# EAGLE schematic s-tuner_bread_board (EAGLE 6.5.0)
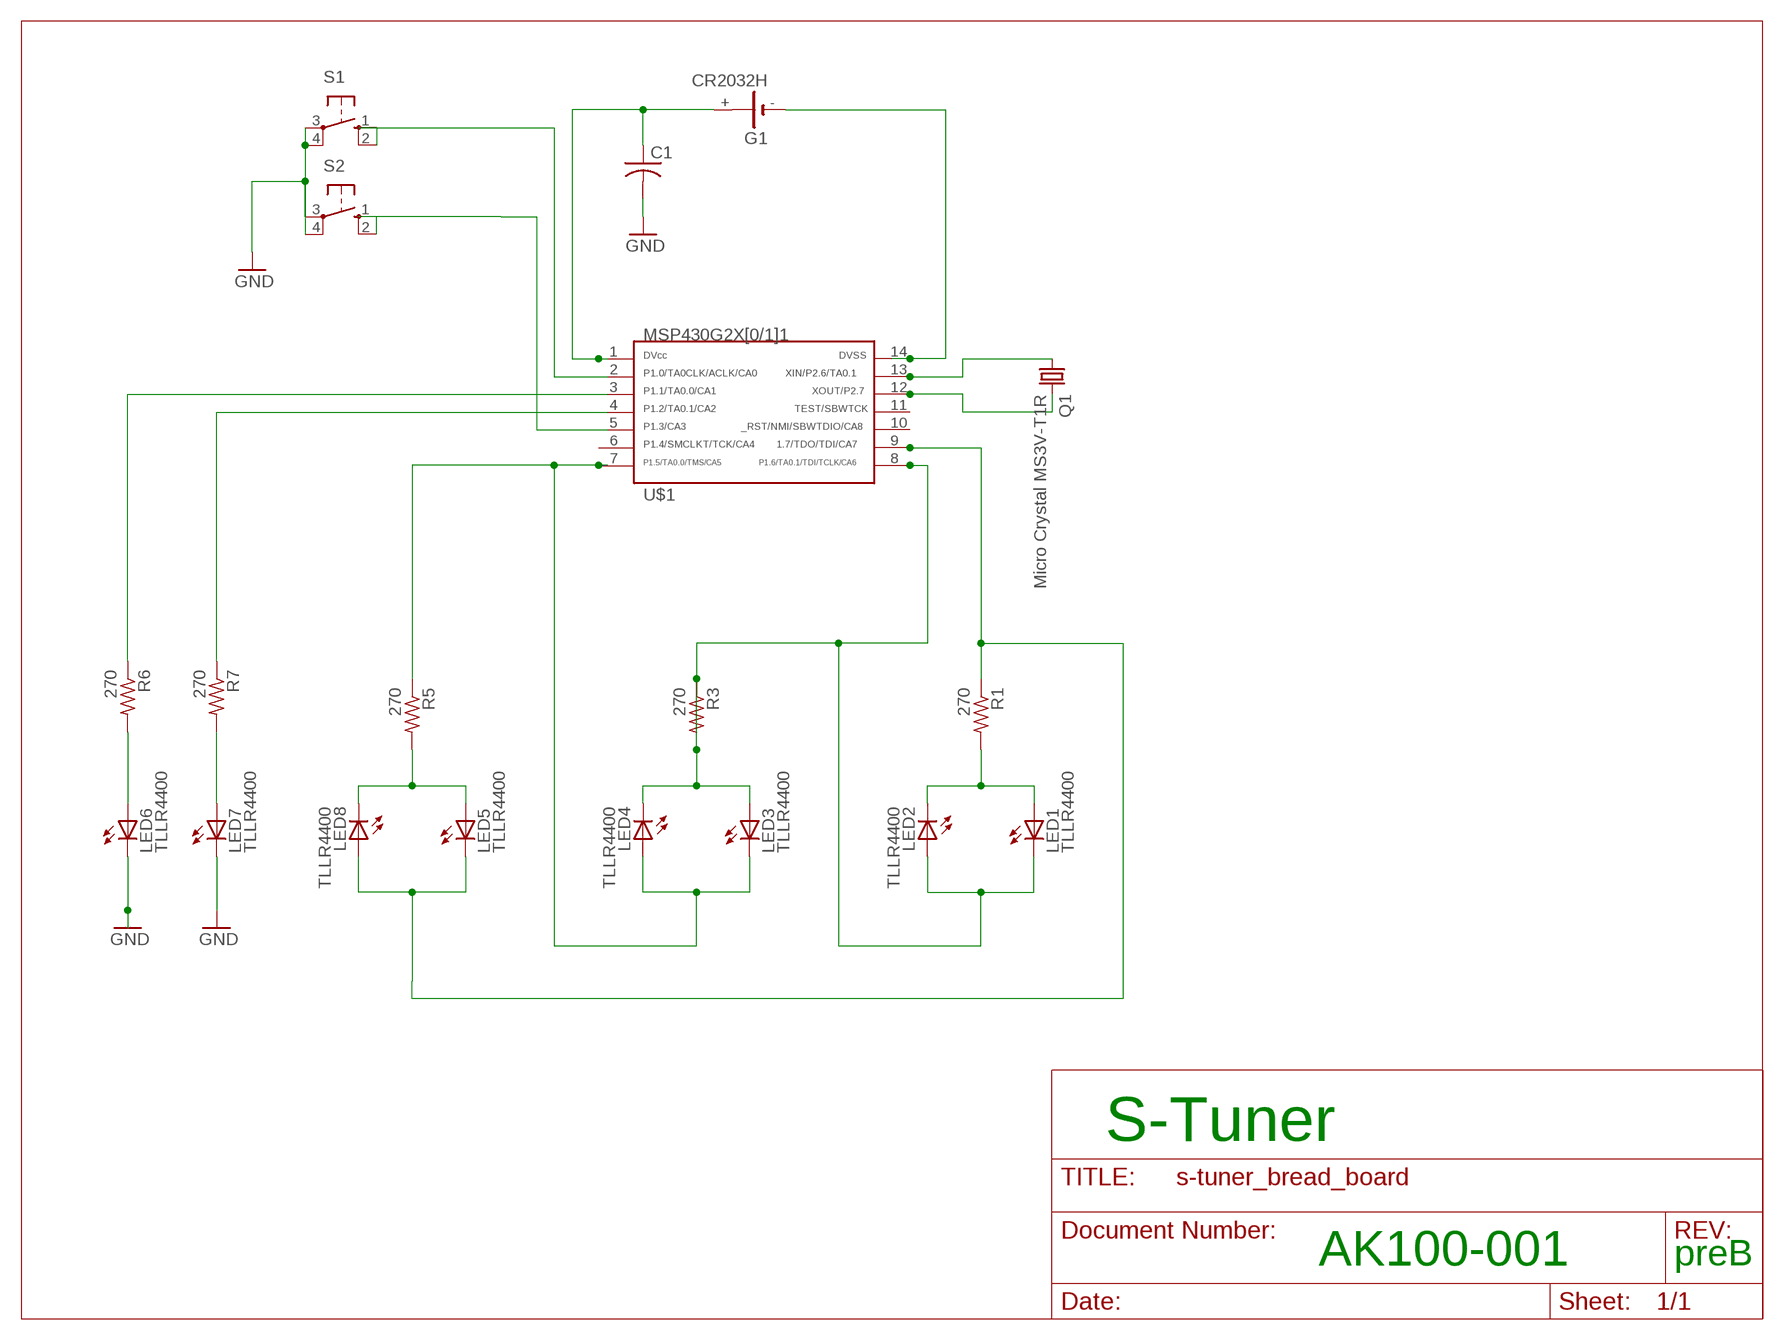
[diagram p0: schematic, sheet 1]

## Parts
C1  C-US025-024X044  [C025-024X044]
G1  CR2032H  [CR2032H]
LED1  TLLR4400  [LED3MM]
LED2  TLLR4400  [LED3MM]
LED3  TLLR4400  [LED3MM]
LED4  TLLR4400  [LED3MM]
LED5  TLLR4400  [LED3MM]
LED6  TLLR4400  [LED3MM]
LED7  TLLR4400  [LED3MM]
LED8  TLLR4400  [LED3MM]
Q1  Micro Crystal MS3V-T1R  CRYSTALTC26H  [TC26H]
R1  270  R-US_R0603  [R0603]
R3  270  R-US_R0603  [R0603]
R5  270  R-US_R0603  [R0603]
R6  270  R-US_R0603  [R0603]
R7  270  R-US_R0603  [R0603]
S1  10-XX  [B3F-10XX]
S2  10-XX  [B3F-10XX]
U$1  G2X[0/1]1---N14  [N14]

## Nets
GND: C1.2 LED6.K(C) LED7.K(C) S1.3(P) S1.4(P1) S2.3(P) S2.4(P1)
N$3: G1.- U$1.14
N$4: LED1.K(C) LED2.A LED3.A LED4.K(C) R3.1 R3.2 U$1.8
N$5: Q1.2 U$1.12
N$6: LED5.K(C) LED8.A R1.1 U$1.9
N$7: C1.1 G1.+ U$1.1
N$8: LED5.A LED8.K(C) R5.2
N$9: LED3.K(C) LED4.A R5.1 U$1.7
N$10: R7.1
N$11: LED1.A LED2.K(C) R1.2
N$12: LED7.A R7.2
N$13: R6.1
N$14: S1.1(S) S1.2(S1)
N$15: S2.1(S) S2.2(S1)
N$17: Q1.1 U$1.13
N$19: LED6.A R6.2
Unconnected: G1.+@1(+) U$1.2 U$1.3 U$1.4 U$1.5 U$1.6 U$1.10 U$1.11

## Notes on the sheet
- S-Tuner
- AK100-001 | preB

## Library data of the parts
C1 = rcl:C-US: CAPACITOR, American symbol
G1 = battery:CR2032H: LI BATTERY Varta
LED1-LED8 = led:TLLR4400: Low Current (2mA) LED 3 mm Tinted Diffused Package color RED Source: Data sheet <http://www.farnell.com/datasheets/391100.pdf>; MF: VISHAY SEMICONDUCTOR; OC_FARNELL: 1612437
Q1 = crystal:CRYSTAL: CRYSTAL; OC_FARNELL: unknown; OC_NEWARK: unknown
R1 R3 R5-R7 = resistor:R-US_: RESISTOR, American symbol
S1 S2 = switch-omron:10-XX: OMRON SWITCH; MPN: B3F-1000; OC_FARNELL: 176432; OC_NEWARK: 36M3542
U$1 = TI_MSP430_v16:G2X[0/1]1---N14: MSP430G2X[0/1]1 MSP430G2001, MSP430G2101, MSP430G2201,MSP430G2111, G2211 PDIP (N) 14 Pin Package http://focus.ti.com/docs/prod/folders/print/msp430g2111.html